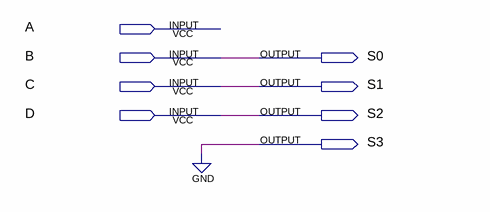
[diagram p0: schematic sheet]
// Quartus schematic Multiplica2.bdf as structural Verilog: 0 symbols, 8 pins
module Multiplica2 (
  input  A,
  input  B,
  input  C,
  input  D,
  output S0,
  output S1,
  output S2,
  output S3
);


  assign S0 = B;
  assign S1 = C;
  assign S2 = D;
  assign S3 = 1'b0;
endmodule
